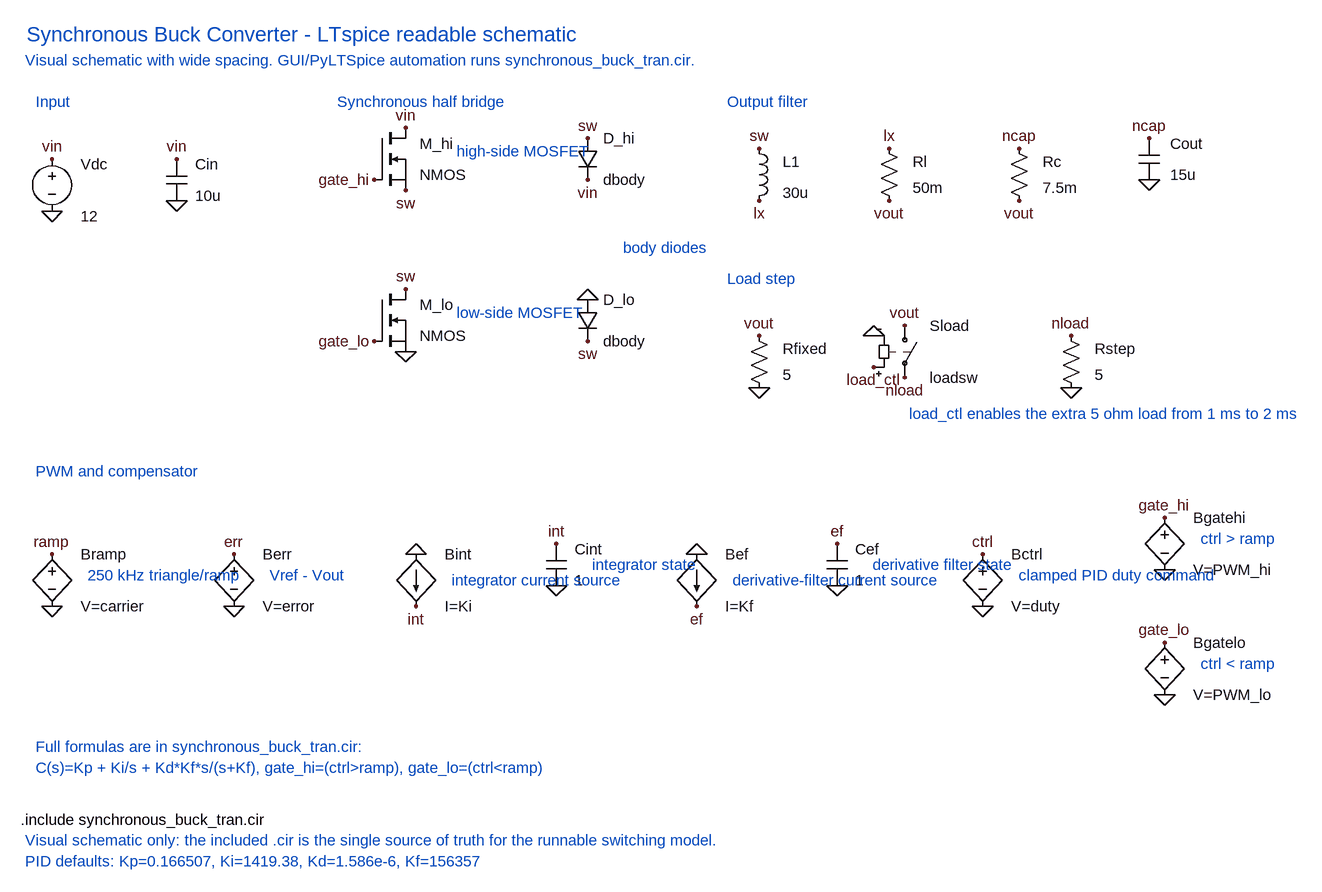
[diagram p0: schematic synchronous_buck.asc]
synchronous_buck.asc, the LTspice schematic file:
Version 4
SHEET 1 2200 1350
TEXT 80 32 Left 3 ; Synchronous Buck Converter - LTspice readable schematic
TEXT 80 72 Left 2 ; Visual schematic with wide spacing. GUI/PyLTSpice automation runs synchronous_buck_tran.cir.
TEXT 80 1240 Left 2 !.include synchronous_buck_tran.cir
TEXT 80 1272 Left 2 ; Visual schematic only: the included .cir is the single source of truth for the runnable switching model.
TEXT 80 1304 Left 2 ; PID defaults: Kp=0.166507, Ki=1419.38, Kd=1.586e-6, Kf=156357

TEXT 96 136 Left 2 ; Input
SYMBOL voltage 128 208 R0
WINDOW 0 44 24 Left 2
WINDOW 3 44 104 Left 2
SYMATTR InstName Vdc
SYMATTR Value 12
FLAG 128 224 vin
FLAG 128 304 0

SYMBOL cap 304 224 R0
WINDOW 0 44 8 Left 2
WINDOW 3 44 56 Left 2
SYMATTR InstName Cin
SYMATTR Value 10u
FLAG 320 224 vin
FLAG 320 288 0

TEXT 560 136 Left 2 ; Synchronous half bridge
SYMBOL nmos 624 176 R0
WINDOW 0 70 24 Left 2
WINDOW 3 70 72 Left 2
SYMATTR InstName M_hi
SYMATTR Value NMOS
FLAG 672 176 vin
FLAG 624 256 gate_hi
FLAG 672 272 sw
TEXT 744 212 Left 2 ; high-side MOSFET

SYMBOL nmos 624 424 R0
WINDOW 0 70 24 Left 2
WINDOW 3 70 72 Left 2
SYMATTR InstName M_lo
SYMATTR Value NMOS
FLAG 672 424 sw
FLAG 624 504 gate_lo
FLAG 672 520 0
TEXT 744 460 Left 2 ; low-side MOSFET

SYMBOL diode 936 192 R0
WINDOW 0 40 0 Left 2
WINDOW 3 40 64 Left 2
SYMATTR InstName D_hi
SYMATTR Value dbody
FLAG 952 192 sw
FLAG 952 256 vin

SYMBOL diode 936 440 R0
WINDOW 0 40 0 Left 2
WINDOW 3 40 64 Left 2
SYMATTR InstName D_lo
SYMATTR Value dbody
FLAG 952 440 0
FLAG 952 504 sw
TEXT 1000 360 Left 2 ; body diodes

TEXT 1160 136 Left 2 ; Output filter
SYMBOL ind 1200 192 R0
WINDOW 0 52 36 Left 2
WINDOW 3 52 84 Left 2
SYMATTR InstName L1
SYMATTR Value 30u
FLAG 1216 208 sw
FLAG 1216 288 lx

SYMBOL res 1400 192 R0
WINDOW 0 52 36 Left 2
WINDOW 3 52 76 Left 2
SYMATTR InstName Rl
SYMATTR Value 50m
FLAG 1416 208 lx
FLAG 1416 288 vout

SYMBOL res 1600 192 R0
WINDOW 0 52 36 Left 2
WINDOW 3 52 76 Left 2
SYMATTR InstName Rc
SYMATTR Value 7.5m
FLAG 1616 208 ncap
FLAG 1616 288 vout

SYMBOL cap 1800 192 R0
WINDOW 0 48 8 Left 2
WINDOW 3 48 56 Left 2
SYMATTR InstName Cout
SYMATTR Value 15u
FLAG 1816 192 ncap
FLAG 1816 256 0

TEXT 1160 408 Left 2 ; Load step
SYMBOL res 1200 480 R0
WINDOW 0 52 36 Left 2
WINDOW 3 52 76 Left 2
SYMATTR InstName Rfixed
SYMATTR Value 5
FLAG 1216 496 vout
FLAG 1216 576 0

SYMBOL sw 1440 464 R0
WINDOW 0 38 16 Left 2
WINDOW 3 38 96 Left 2
SYMATTR InstName Sload
SYMATTR Value loadsw
FLAG 1440 480 vout
FLAG 1440 560 nload
FLAG 1392 544 load_ctl
FLAG 1392 496 0

SYMBOL res 1680 480 R0
WINDOW 0 52 36 Left 2
WINDOW 3 52 76 Left 2
SYMATTR InstName Rstep
SYMATTR Value 5
FLAG 1696 496 nload
FLAG 1696 576 0
TEXT 1440 616 Left 2 ; load_ctl enables the extra 5 ohm load from 1 ms to 2 ms

TEXT 96 704 Left 2 ; PWM and compensator
SYMBOL bv 128 816 R0
WINDOW 0 44 16 Left 2
WINDOW 3 44 96 Left 2
SYMATTR InstName Bramp
SYMATTR Value V=carrier
FLAG 128 832 ramp
FLAG 128 912 0
TEXT 176 864 Left 2 ; 250 kHz triangle/ramp

SYMBOL bv 408 816 R0
WINDOW 0 44 16 Left 2
WINDOW 3 44 96 Left 2
SYMATTR InstName Berr
SYMATTR Value V=error
FLAG 408 832 err
FLAG 408 912 0
TEXT 456 864 Left 2 ; Vref - Vout

SYMBOL bi 688 832 R0
WINDOW 0 44 0 Left 2
WINDOW 3 44 80 Left 2
SYMATTR InstName Bint
SYMATTR Value I=Ki
FLAG 688 832 0
FLAG 688 912 int
TEXT 736 872 Left 2 ; integrator current source

SYMBOL cap 888 816 R0
WINDOW 0 44 8 Left 2
WINDOW 3 44 56 Left 2
SYMATTR InstName Cint
SYMATTR Value 1
FLAG 904 816 int
FLAG 904 880 0
TEXT 952 848 Left 2 ; integrator state

SYMBOL bi 1120 832 R0
WINDOW 0 44 0 Left 2
WINDOW 3 44 80 Left 2
SYMATTR InstName Bef
SYMATTR Value I=Kf
FLAG 1120 832 0
FLAG 1120 912 ef
TEXT 1168 872 Left 2 ; derivative-filter current source

SYMBOL cap 1320 816 R0
WINDOW 0 44 8 Left 2
WINDOW 3 44 56 Left 2
SYMATTR InstName Cef
SYMATTR Value 1
FLAG 1336 816 ef
FLAG 1336 880 0
TEXT 1384 848 Left 2 ; derivative filter state

SYMBOL bv 1560 816 R0
WINDOW 0 44 16 Left 2
WINDOW 3 44 96 Left 2
SYMATTR InstName Bctrl
SYMATTR Value V=duty
FLAG 1560 832 ctrl
FLAG 1560 912 0
TEXT 1608 864 Left 2 ; clamped PID duty command

SYMBOL bv 1840 760 R0
WINDOW 0 44 16 Left 2
WINDOW 3 44 96 Left 2
SYMATTR InstName Bgatehi
SYMATTR Value V=PWM_hi
FLAG 1840 776 gate_hi
FLAG 1840 856 0
TEXT 1888 808 Left 2 ; ctrl > ramp

SYMBOL bv 1840 952 R0
WINDOW 0 44 16 Left 2
WINDOW 3 44 96 Left 2
SYMATTR InstName Bgatelo
SYMATTR Value V=PWM_lo
FLAG 1840 968 gate_lo
FLAG 1840 1048 0
TEXT 1888 1000 Left 2 ; ctrl < ramp

TEXT 96 1128 Left 2 ; Full formulas are in synchronous_buck_tran.cir:
TEXT 96 1160 Left 2 ; C(s)=Kp + Ki/s + Kd*Kf*s/(s+Kf), gate_hi=(ctrl>ramp), gate_lo=(ctrl<ramp)

The netlist it stands for:
* synchronous_buck.asc
Vdc vin 0 12
Cin vin 0 10u
M_hi vin gate_hi sw sw NMOS
M_lo sw gate_lo 0 0 NMOS
D_hi sw vin dbody
D_lo 0 sw dbody
L1 sw lx 30u
Rl lx vout 50m
Rc ncap vout 7.5m
Cout ncap 0 15u
Rfixed vout 0 5
Sload vout nload load_ctl 0 loadsw
Rstep nload 0 5
Bramp ramp 0 V=carrier
Berr err 0 V=error
Bint 0 int I=Ki
Cint int 0 1
Bef 0 ef I=Kf
Cef ef 0 1
Bctrl ctrl 0 V=duty
Bgatehi gate_hi 0 V=PWM_hi
Bgatelo gate_lo 0 V=PWM_lo
.model D D
.lib standard.dio
.model NMOS NMOS
.model PMOS PMOS
.lib standard.mos
*  Synchronous Buck Converter - LTspice readable schematic
*  Visual schematic with wide spacing. GUI/PyLTSpice automation runs synchronous_buck_tran.cir.
.include synchronous_buck_tran.cir
*  Visual schematic only: the included .cir is the single source of truth for the runnable switching model.
*  PID defaults: Kp=0.166507, Ki=1419.38, Kd=1.586e-6, Kf=156357
*  Input
*  Synchronous half bridge
*  high-side MOSFET
*  low-side MOSFET
*  body diodes
*  Output filter
*  Load step
*  load_ctl enables the extra 5 ohm load from 1 ms to 2 ms
*  PWM and compensator
*  250 kHz triangle/ramp
*  Vref - Vout
*  integrator current source
*  integrator state
*  derivative-filter current source
*  derivative filter state
*  clamped PID duty command
*  ctrl > ramp
*  ctrl < ramp
*  Full formulas are in synchronous_buck_tran.cir:
*  C(s)=Kp + Ki/s + Kd*Kf*s/(s+Kf), gate_hi=(ctrl>ramp), gate_lo=(ctrl<ramp)
.backanno
.end